# EAGLE design main_board (EAGLE 6.4)
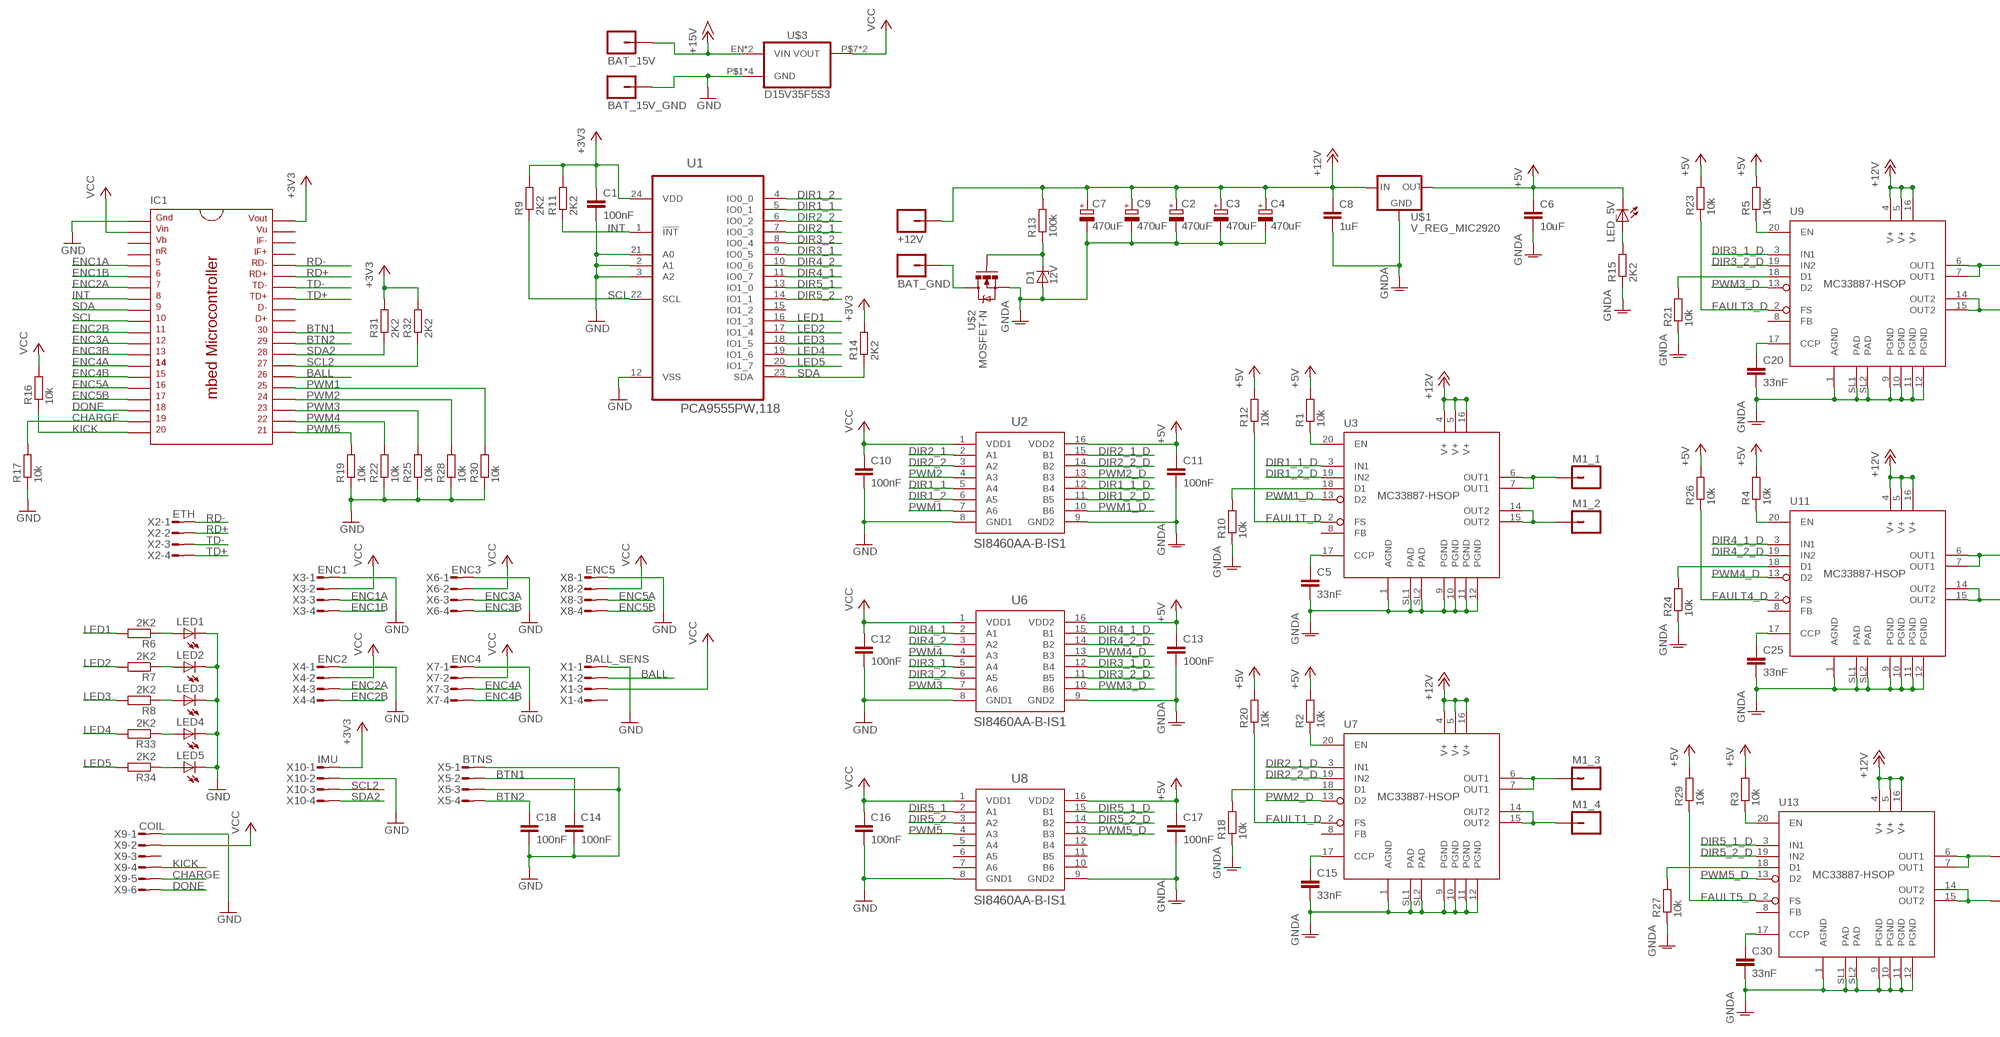
[diagram p0: schematic, sheet 1, part 1 of 2]
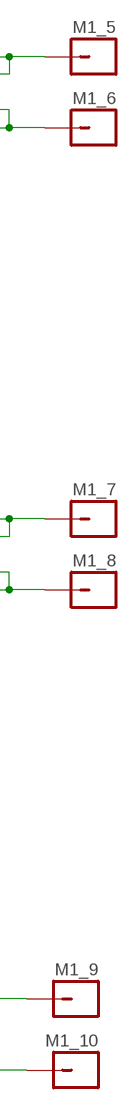
[diagram p1: schematic, sheet 1, part 2 of 2]

## Parts
+12V  M01_PWR  [PWR_HOLE]
BAT_15V  M01_WIRE  [WIRE_HOLE]
BAT_15V_GND  M01_WIRE  [WIRE_HOLE]
BAT_GND  M01_PWR  [PWR_HOLE]
C1  100nF  C-EUC0603K  [C0603K]
C2  470uF  CPOL-EUE3.5-8  [E3,5-8]
C3  470uF  CPOL-EUE3.5-8  [E3,5-8]
C4  470uF  CPOL-EUE3.5-8  [E3,5-8]
C5  33nF  C-EUC0603K  [C0603K]
C6  10uF  C-EUC1206K  [C1206K]
C7  470uF  CPOL-EUE3.5-8  [E3,5-8]
C8  1uF  C-EUC0603K  [C0603K]
C9  470uF  CPOL-EUE3.5-8  [E3,5-8]
C10  100nF  C-EUC0603K  [C0603K]
C11  100nF  C-EUC0603K  [C0603K]
C12  100nF  C-EUC0603K  [C0603K]
C13  100nF  C-EUC0603K  [C0603K]
C14  100nF  C-EUC0603K  [C0603K]
C15  33nF  C-EUC0603K  [C0603K]
C16  100nF  C-EUC0603K  [C0603K]
C17  100nF  C-EUC0603K  [C0603K]
C18  100nF  C-EUC0603K  [C0603K]
C20  33nF  C-EUC0603K  [C0603K]
C25  33nF  C-EUC0603K  [C0603K]
C30  33nF  C-EUC0603K  [C0603K]
D1  12V  ZENER-DIODESOD123  [SOD123]
IC1  MBED_MICROCONTROLLER  [DIL40_0.9]
LED1  LEDCHIP-LED0603  [CHIP-LED0603]
LED2  LEDCHIP-LED0603  [CHIP-LED0603]
LED3  LEDCHIP-LED0603  [CHIP-LED0603]
LED4  LEDCHIP-LED0603  [CHIP-LED0603]
LED5  LEDCHIP-LED0603  [CHIP-LED0603]
LED_5V  LEDCHIP-LED0603  [CHIP-LED0603]
M1_1  M01_WIRE  [WIRE_HOLE]
M1_2  M01_WIRE  [WIRE_HOLE]
M1_3  M01_WIRE  [WIRE_HOLE]
M1_4  M01_WIRE  [WIRE_HOLE]
M1_5  M01_WIRE  [WIRE_HOLE]
M1_6  M01_WIRE  [WIRE_HOLE]
M1_7  M01_WIRE  [WIRE_HOLE]
M1_8  M01_WIRE  [WIRE_HOLE]
M1_9  M01_WIRE  [WIRE_HOLE]
M1_10  M01_WIRE  [WIRE_HOLE]
R1  10k  R-EU_R0603  [R0603]
R2  10k  R-EU_R0603  [R0603]
R3  10k  R-EU_R0603  [R0603]
R4  10k  R-EU_R0603  [R0603]
R5  10k  R-EU_R0603  [R0603]
R6  2K2  R-EU_R0603  [R0603]
R7  2K2  R-EU_R0603  [R0603]
R8  2K2  R-EU_R0603  [R0603]
R9  2K2  R-EU_R0603  [R0603]
R10  10k  R-EU_R0603  [R0603]
R11  2K2  R-EU_R0603  [R0603]
R12  10k  R-EU_R0603  [R0603]
R13  100k  R-EU_R0603  [R0603]
R14  2K2  R-EU_R0603  [R0603]
R15  2K2  R-EU_R0603  [R0603]
R16  10k  R-EU_R0603  [R0603]
R17  10k  R-EU_R0603  [R0603]
R18  10k  R-EU_R0603  [R0603]
R19  10k  R-EU_R0603  [R0603]
R20  10k  R-EU_R0603  [R0603]
R21  10k  R-EU_R0603  [R0603]
R22  10k  R-EU_R0603  [R0603]
R23  10k  R-EU_R0603  [R0603]
R24  10k  R-EU_R0603  [R0603]
R25  10k  R-EU_R0603  [R0603]
R26  10k  R-EU_R0603  [R0603]
R27  10k  R-EU_R0603  [R0603]
R28  10k  R-EU_R0603  [R0603]
R29  10k  R-EU_R0603  [R0603]
R30  10k  R-EU_R0603  [R0603]
R31  2K2  R-EU_R0603  [R0603]
R32  2K2  R-EU_R0603  [R0603]
R33  2K2  R-EU_R0603  [R0603]
R34  2K2  R-EU_R0603  [R0603]
U1  PCA9555PW,118  [SOP65P640X110-24N]
U2  SI8460AA-B-IS1  [SOIC-16]
U3  MC33887-HSOP  [HSOP]
U6  SI8460AA-B-IS1  [SOIC-16]
U7  MC33887-HSOP  [HSOP]
U8  SI8460AA-B-IS1  [SOIC-16]
U9  MC33887-HSOP  [HSOP]
U11  MC33887-HSOP  [HSOP]
U13  MC33887-HSOP  [HSOP]
U$1  V_REG_MIC2920  [SOT223]
U$2  MOSFET-N  MOSFET-N-SOT669  [TO127P600X120-5N]
U$3  D15V35F5S3  [D15V35F5S3]
X1  BALL_SENS  MICROMATCH-4  [MICROMATCH-4]
X2  ETH  MICROMATCH-4  [MICROMATCH-4]
X3  ENC1  MICROMATCH-4  [MICROMATCH-4]
X4  ENC2  MICROMATCH-4  [MICROMATCH-4]
X5  BTNS  MICROMATCH-4  [MICROMATCH-4]
X6  ENC3  MICROMATCH-4  [MICROMATCH-4]
X7  ENC4  MICROMATCH-4  [MICROMATCH-4]
X8  ENC5  MICROMATCH-4  [MICROMATCH-4]
X9  COIL  MICROMATCH-6  [MICROMATCH-6]
X10  IMU  MICROMATCH-4  [MICROMATCH-4]

## Nets
+3V3: C1.1 IC1.40 R9.2 R11.2 R14.2 R31.2 R32.2 U1.24(VDD) X10.1
+5V: C6.1 C11.1 C13.1 C17.1 LED_5V.C R1.2 R2.2 R3.2 R4.2 R5.2 R12.2 R20.2 R23.2 R26.2 R29.2 U2.16(VDD2) U6.16(VDD2) U8.16(VDD2) U$1.3(OUT)
+12V: +12V.P$1 C2.+ C3.+ C4.+ C7.+ C8.1 C9.+ R13.2 U3.4(V+) U3.5(V+) U3.16(V+) U7.4(V+) U7.5(V+) U7.16(V+) U9.4(V+) U9.5(V+) U9.16(V+) U11.4(V+) U11.5(V+) U11.16(V+) U13.4(V+) U13.5(V+) U13.16(V+) U$1.1(IN)
+15V: BAT_15V.P$1 U$3.EN(VIN) U$3.P$5(VIN)
BALL: IC1.26 X1.2
BTN1: C14.1 IC1.30 X5.2
BTN2: C18.1 IC1.29 X5.4
CHARGE: IC1.19 R17.2 X9.5
DIR1_1: U1.5(IO0_1) U2.5(A4)
DIR1_1_D: U2.12(B4) U3.3(IN1)
DIR1_2: U1.4(IO0_0) U2.6(A5)
DIR1_2_D: U2.11(B5) U3.19(IN2)
DIR2_1: U1.7(IO0_3) U2.2(A1)
DIR2_1_D: U2.15(B1) U7.3(IN1)
DIR2_2: U1.6(IO0_2) U2.3(A2)
DIR2_2_D: U2.14(B2) U7.19(IN2)
DIR3_1: U1.9(IO0_5) U6.5(A4)
DIR3_1_D: U6.12(B4) U9.3(IN1)
DIR3_2: U1.8(IO0_4) U6.6(A5)
DIR3_2_D: U6.11(B5) U9.19(IN2)
DIR4_1: U1.11(IO0_7) U6.2(A1)
DIR4_1_D: U6.15(B1) U11.3(IN1)
DIR4_2: U1.10(IO0_6) U6.3(A2)
DIR4_2_D: U6.14(B2) U11.19(IN2)
DIR5_1: U1.13(IO1_0) U8.2(A1)
DIR5_1_D: U8.15(B1) U13.3(IN1)
DIR5_2: U1.14(IO1_1) U8.3(A2)
DIR5_2_D: U8.14(B2) U13.19(IN2)
DONE: IC1.18 X9.6
ENC1A: IC1.5 X3.3
ENC1B: IC1.6 X3.4
ENC2A: IC1.7 X4.3
ENC2B: IC1.11 X4.4
ENC3A: IC1.12 X6.3
ENC3B: IC1.13 X6.4
ENC4A: IC1.14 X7.3
ENC4B: IC1.15 X7.4
ENC5A: IC1.16 X8.3
ENC5B: IC1.17 X8.4
FAUL1T_D: R12.1 U3.2(FS)
FAULT1_D: R20.1 U7.2(FS)
FAULT3_D: R23.1 U9.2(FS)
FAULT4_D: R26.1 U11.2(FS)
FAULT5_D: R29.1 U13.2(FS)
GND: BAT_15V_GND.P$1 C1.2 C10.2 C12.2 C14.2 C16.2 C18.2 IC1.1 LED1.C LED2.C LED3.C LED4.C LED5.C R17.1 R19.1 R22.1 R25.1 R28.1 R30.1 U1.2(A1) U1.3(A2) U1.12(VSS) U1.21(A0) U2.8(GND1) U6.8(GND1) U8.8(GND1) U$3.P$1(GND) U$3.P$2(GND) U$3.P$3(GND) U$3.P$4(GND) X1.1 X3.1 X4.1 X5.1 X5.3 X6.1 X7.1 X8.1 X9.1 X10.2
GNDA: C2.- C3.- C4.- C5.2 C6.2 C7.- C8.2 C9.- C11.2 C13.2 C15.2 C17.2 C20.2 C25.2 C30.2 D1.A R10.1 R15.1 R18.1 R21.1 R24.1 R27.1 U2.9(GND2) U3.1(AGND) U3.9(PGND) U3.10(PGND) U3.11(PGND) U3.12(PGND) U3.SL1(PAD) U3.SL2(PAD) U6.9(GND2) U7.1(AGND) U7.9(PGND) U7.10(PGND) U7.11(PGND) U7.12(PGND) U7.SL1(PAD) U7.SL2(PAD) U8.9(GND2) U9.1(AGND) U9.9(PGND) U9.10(PGND) U9.11(PGND) U9.12(PGND) U9.SL1(PAD) U9.SL2(PAD) U11.1(AGND) U11.9(PGND) U11.10(PGND) U11.11(PGND) U11.12(PGND) U11.SL1(PAD) U11.SL2(PAD) U13.1(AGND) U13.9(PGND) U13.10(PGND) U13.11(PGND) U13.12(PGND) U13.SL1(PAD) U13.SL2(PAD) U$1.2(GND) U$1.4(GND) U$2.1(S) U$2.2(S) U$2.3(S)
INT: IC1.8 R11.1 U1.1(!INT)
KICK: IC1.20 R16.1 X9.4
LED1: R6.2 U1.16(IO1_3)
LED2: R7.2 U1.17(IO1_4)
LED3: R8.2 U1.18(IO1_5)
LED4: R33.2 U1.19(IO1_6)
LED5: R34.2 U1.20(IO1_7)
N$2: R1.1 U3.20(EN)
N$3: R2.1 U7.20(EN)
N$4: R3.1 U13.20(EN)
N$5: R4.1 U11.20(EN)
N$6: R5.1 U9.20(EN)
N$7: LED1.A R6.1
N$8: LED2.A R7.1
N$9: LED3.A R8.1
N$10: LED_5V.A R15.2
N$11: LED4.A R33.1
N$12: LED5.A R34.1
N$15: C5.1 U3.17(CCP)
N$18: R10.2 U3.18(D1)
N$20: D1.C R13.1 U$2.4(G)
N$21: BAT_GND.P$1 U$2.5(D)
N$23: M1_1.P$1 U3.6(OUT1) U3.7(OUT1)
N$25: M1_2.P$1 U3.14(OUT2) U3.15(OUT2)
N$31: C15.1 U7.17(CCP)
N$33: R18.2 U7.18(D1)
N$34: M1_3.P$1 U7.6(OUT1) U7.7(OUT1)
N$35: M1_4.P$1 U7.14(OUT2) U7.15(OUT2)
N$36: C20.1 U9.17(CCP)
N$38: R21.2 U9.18(D1)
N$39: M1_5.P$1 U9.6(OUT1) U9.7(OUT1)
N$40: M1_6.P$1 U9.14(OUT2) U9.15(OUT2)
N$41: C25.1 U11.17(CCP)
N$43: R24.2 U11.18(D1)
N$44: M1_7.P$1 U11.6(OUT1) U11.7(OUT1)
N$45: M1_8.P$1 U11.14(OUT2) U11.15(OUT2)
N$46: C30.1 U13.17(CCP)
N$48: R27.2 U13.18(D1)
N$49: M1_9.P$1 U13.6(OUT1) U13.7(OUT1)
N$50: M1_10.P$1 U13.14(OUT2) U13.15(OUT2)
PWM1: IC1.25 R30.2 U2.7(A6)
PWM1_D: U2.10(B6) U3.13(D2)
PWM2: IC1.24 R28.2 U2.4(A3)
PWM2_D: U2.13(B3) U7.13(D2)
PWM3: IC1.23 R25.2 U6.7(A6)
PWM3_D: U6.10(B6) U9.13(D2)
PWM4: IC1.22 R22.2 U6.4(A3)
PWM4_D: U6.13(B3) U11.13(D2)
PWM5: IC1.21 R19.2 U8.4(A3)
PWM5_D: U8.13(B3) U13.13(D2)
RD+: IC1.35 X2.2
RD-: IC1.36 X2.1
SCL: IC1.10 R9.1 U1.22(SCL)
SCL2: IC1.27 R32.1 X10.3
SDA: IC1.9 R14.1 U1.23(SDA)
SDA2: IC1.28 R31.1 X10.4
TD+: IC1.33 X2.4
TD-: IC1.34 X2.3
VCC: C10.1 C12.1 C16.1 IC1.2 R16.2 U2.1(VDD1) U6.1(VDD1) U8.1(VDD1) U$3.P$7(VOUT) U$3.P$8(VOUT) X1.3 X3.2 X4.2 X6.2 X7.2 X8.2 X9.2
Unconnected: IC1.3 IC1.4 IC1.31 IC1.32 IC1.37 IC1.38 IC1.39 U1.15(IO1_2) U3.8(FB) U7.8(FB) U8.5(A4) U8.6(A5) U8.7(A6) U8.10(B6) U8.11(B5) U8.12(B4) U9.8(FB) U11.8(FB) U13.8(FB) X1.4 X9.3

## Library data of the parts
+12V BAT_GND = tellis2:M01_PWR
BAT_15V BAT_15V_GND M1_1-M1_10 = tellis2:M01_WIRE
C1 C5 C6 C8 C10-C18 C20 C25 C30 = rcl:C-EU: CAPACITOR, European symbol
C2-C4 C7 C9 = rcl:CPOL-EU: POLARIZED CAPACITOR, European symbol
D1 = diode:ZENER-DIODE: Z-Diode
IC1 = mbed-microcontroller:MBED_MICROCONTROLLER: mbed Microcontroller, DIP40, 0.9"
LED1-LED5 LED_5V = led:LED: LED OSRAM: - CHIPLED LG R971, LG N971, LY N971, LG Q971, LY Q971, LO R971, LY R971 LH N974, LH R974 LS Q976, LO Q976, LY Q976 LO Q996 - Hyper CHIPLED LW Q18S LB Q993, LB Q99A, LB R99A - SideLED LS A670, LO A670, LY A670, LG A670, LP A670 LB A673, LV A673, LT A673, LW A673 LH A674 LY A675 LS A676, LA A676, LO A676, LY A676, LW A676 LS A679, LY A679, LG A679 - Hyper Micro SIDELED® LS Y876, LA Y876, LO Y876, LY Y876 LT Y87S - SmartLED LW L88C, LW L88S LB L89C, LB L89S, LG L890 LS L89K, LO L89K, LY L89K LS L896, LA L896, LO L896, LY L896 - TOPLED LS T670, LO T670, LY T670, LG T670, LP T670 LSG T670, LSP T670, LSY T670, LOP T670, LYG T670 LG T671, LOG T671, LSG T671 LB T673, LV T673, LT T673, LW T673 LH T674 LS T676, LA T676, LO T676, LY T676, LB T676, LH T676, LSB T676, LW T676 LB T67C, LV T67C, LT T67C, LS T67K, LO T67K, LY T67K, LW E67C LS E67B, LA E67B, LO E67B, LY E67B, LB E67C, LV E67C, LT E67C LW T67C LS T679, LY T679, LG T679 LS T770, LO T770, LY T770, LG T770, LP T770 LB T773, LV T773, LT T773, LW T773 LH T774 LS E675, LA E675, LY E675, LS T675 LS T776, LA T776, LO T776, LY T776, LB T776 LHGB T686 LT T68C, LB T68C - Hyper Mini TOPLED® LB M676 - Mini TOPLED Santana® LG M470 LS M47K, LO M47K, LY M47K Source: http://www.osram.convergy.de LUXEON: - LUMILED® LXK2-PW12-R00, LXK2-PW12-S00, LXK2-PW14-U00, LXK2-PW14-V00 LXK2-PM12-R00, LXK2-PM12-S00, LXK2-PM14-U00 LXK2-PE12-Q00, LXK2-PE12-R00, LXK2-PE12-S00, LXK2-PE14-T00, LXK2-PE14-U00 LXK2-PB12-K00, LXK2-PB12-L00, LXK2-PB12-M00, LXK2-PB14-N00, LXK2-PB14-P00, LXK2-PB14-Q00 LXK2-PR12-L00, LXK2-PR12-M00, LXK2-PR14-Q00, LXK2-PR14-R00 LXK2-PD12-Q00, LXK2-PD12-R00, LXK2-PD12-S00 LXK2-PH12-R00, LXK2-PH12-S00 LXK2-PL12-P00, LXK2-PL12-Q00, LXK2-PL12-R00 Source: www.luxeon.com KINGBRIGHT: KA-3528ASYC Source: www.kingbright.com
R1-R34 = rcl:R-EU_: RESISTOR, European symbol
U1 = PCA9555:PCA9555PW,118: IC, I/O EXPANDER, 16BIT, 24TSSOP; MPN: PCA9555PW,118; OC_FARNELL: 2101299; OC_NEWARK: 70R6680; PACKAGE: 24TSSOP; SUPPLIER: NXP
U2 U6 U8 = si8460:SI8460AA-B-IS1
U3 U7 U9 U11 U13 = mc33887:MC33887-HSOP: 5.0 A H-Bridge with Load Current Feedback
U$1 = SparkFun-PowerIC:V_REG_MIC2920: MIC2920A (http://www.micrel.com/_PDF/mic2920.pdf) - 400mA output LDO Regulator
U$2 = nxp_sot669:MOSFET-N-SOT669
U$3 = D15V35F5S3:D15V35F5S3
X1-X8 X10 = con-amp-micromatch:MICROMATCH-4: MicroMaTch 4 7-215464-4 / 0-215464-4 Drawing Number C-215464 DDEController.pdf; MPN: 7-215464-4; OC_FARNELL: 3784629; OC_NEWARK: 19R8124
X9 = con-amp-micromatch:MICROMATCH-6: MicroMaTch 6 7-215464-6 / 0-215464-6 Drawing Number C-215464 DDEController.pdf; MPN: 7-215464-6; OC_FARNELL: 3784630; OC_NEWARK: 19R8125

## Board
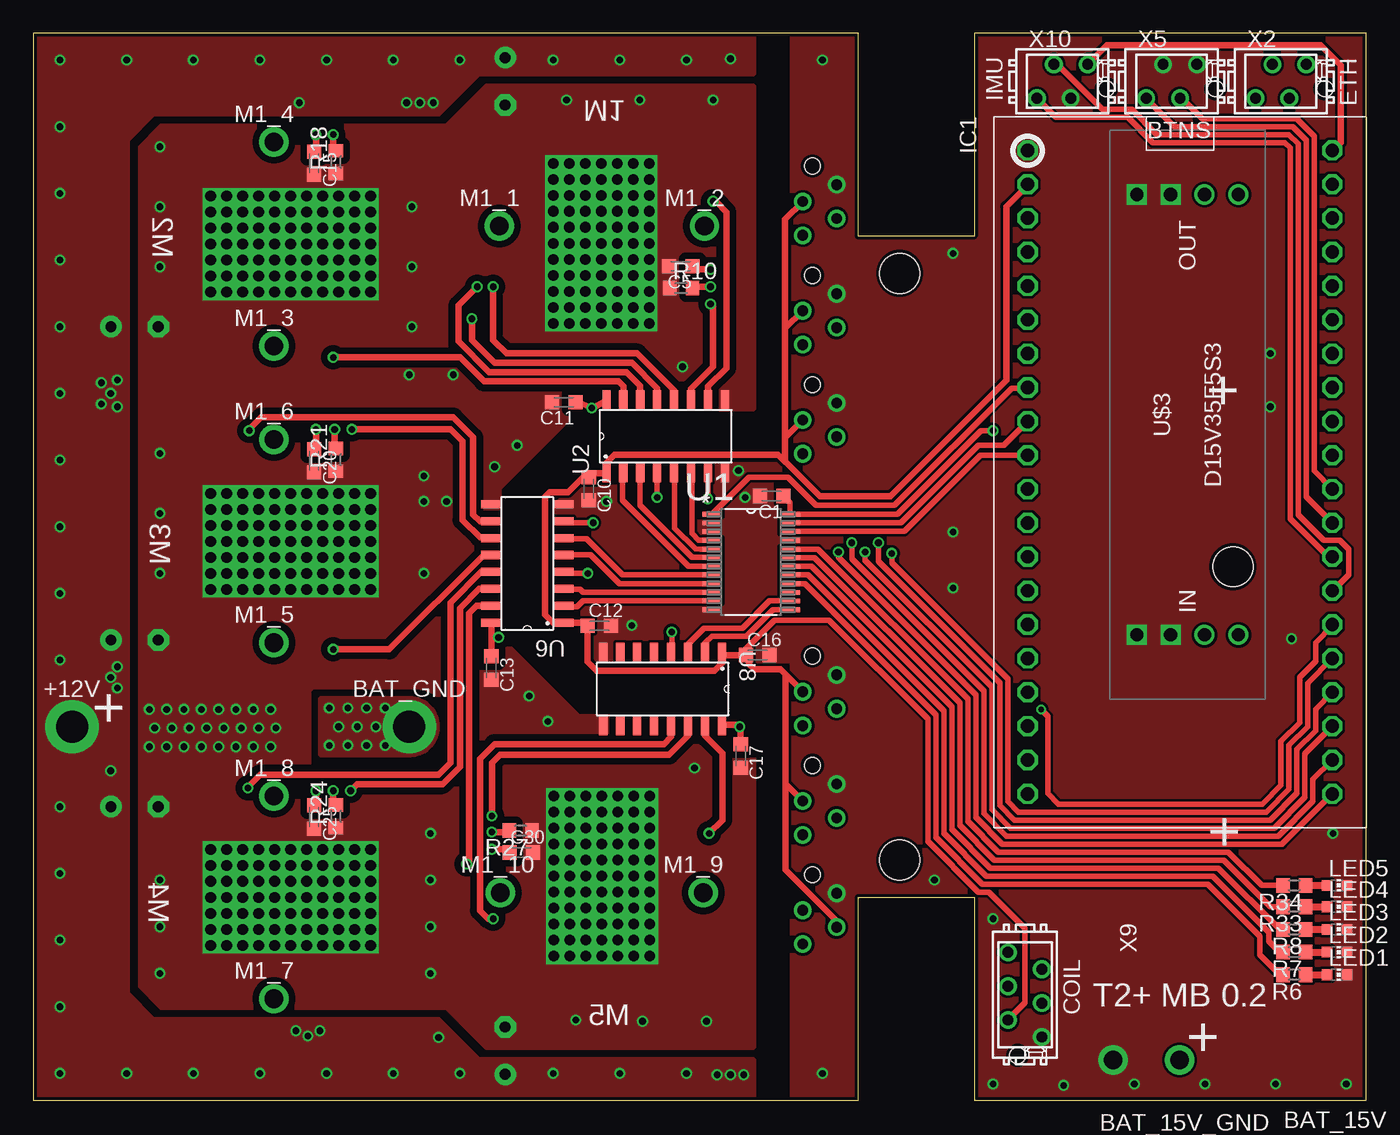
[diagram p2: board, top side]
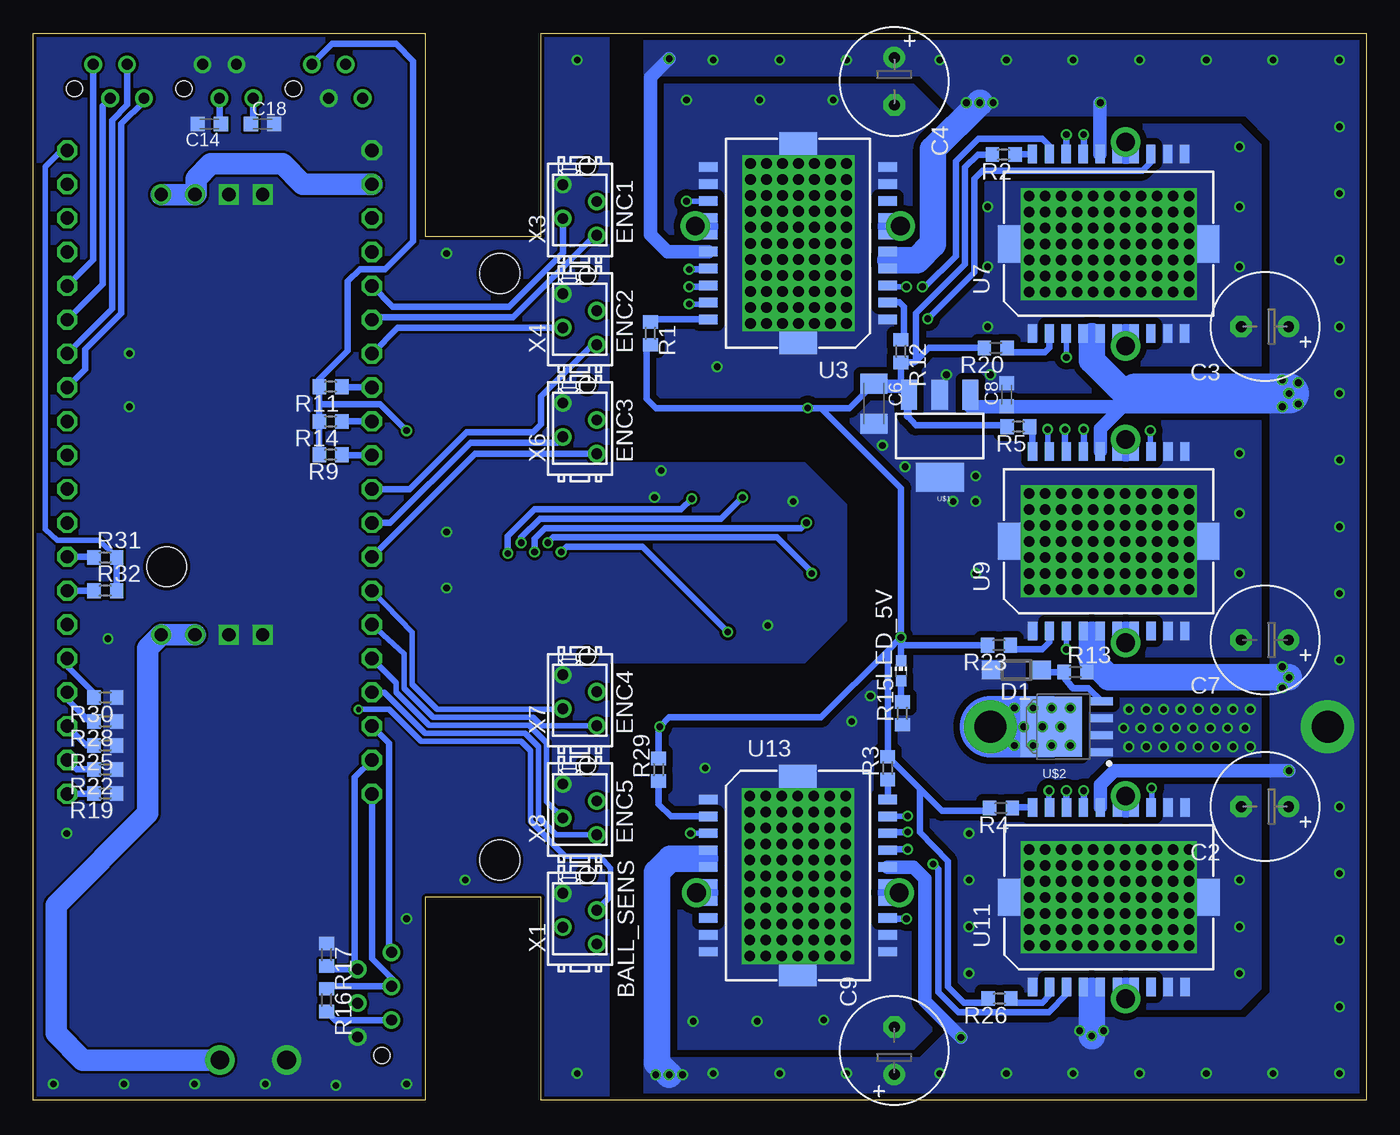
[diagram p3: board, bottom side, seen from below]

Size 100 x 80 mm. Coordinates in mm from the lower left corner, seen from the top.
Outline: 0,0 61.9,0 61.9,15.2 70.6,15.2 70.6,0 100,0 100,80 70.6,80 70.6,64.8 61.9,64.8 61.9,80 0,80 0,0
Copper layers (1*16): Top 0.035mm / dielectric 1.5mm / Bottom 0.035mm
Design rules "Fusion_eagle_rule_v1.1 *": minimum track width 6mil, minimum drill 12mil, track to track 0.2mm, track to pad 0.2mm, pad to pad 0.2mm, via to via 0.2mm, smd to smd 0mil, copper to edge 10mil, drill to drill 10mil, minimum pad ring 10mil, minimum via ring 6mil, stop-mask expansion 2mil, vias tented up to drill 100mil, thermal gap 10mil
Holes 1.2 mm at 58.45,33.3 58.45,25.1 58.45,16.9 58.45,53.65 58.45,61.85 58.45,70.05 80.5,75.85 88.7,75.85 96.9,75.85 73.85,3.35
Holes 3 mm at 65,62 65,18 90,40

### Footprints (pad centres in the part's own frame; a part is rotated, then mirrored left to right if it is on the bottom)
PWR_HOLE = drill 2.4 pad 4: P$1 0,0
WIRE_HOLE = drill 1.4 pad 2.2: P$1 0,0
C0603K = smd 1.05 x 1.08: 1 -0.875,0; 2 0.875,0
E3,5-8 = drill 0.813 pad 1.6: + -1.778,0 | drill 0.813 pad 1.6 octagon: - 1.778,0
C1206K = smd 1.5 x 2: 1 -1.5,0; 2 1.5,0
SOD123 = smd 1.4 x 1.4: A 1.9,0; C -1.9,0
DIL40_0.9 = drill 1 pad 1.397 octagon: 1 -22.86,-11.43; 2 -20.32,-11.43; 3 -17.78,-11.43; 4 -15.24,-11.43; 5 -12.7,-11.43; 6 -10.16,-11.43; 7 -7.62,-11.43; 8 -5.08,-11.43; 9 -2.54,-11.43; 10 0,-11.43; 11 2.54,-11.43; 12 5.08,-11.43; 13 7.62,-11.43; 14 10.16,-11.43; 15 12.7,-11.43; 16 15.24,-11.43; 17 17.78,-11.43; 18 20.32,-11.43; 19 22.86,-11.43; 20 25.4,-11.43; 21 25.4,11.43; 22 22.86,11.43; 23 20.32,11.43; 24 17.78,11.43; 25 15.24,11.43; 26 12.7,11.43; 27 10.16,11.43; 28 7.62,11.43; 29 5.08,11.43; 30 2.54,11.43; 31 0,11.43; 32 -2.54,11.43; 33 -5.08,11.43; 34 -7.62,11.43; 35 -10.16,11.43; 36 -12.7,11.43; 37 -15.24,11.43; 38 -17.78,11.43; 39 -20.32,11.43; 40 -22.86,11.43
CHIP-LED0603 = smd 0.8 x 0.8: A 0,-0.75; C 0,0.75
R0603 = smd 1 x 1.1: 1 -0.85,0; 2 0.85,0
SOP65P640X110-24N = smd 1.473 x 0.356: 1 -2.921,3.581; 2 -2.921,2.921; 3 -2.921,2.286; 4 -2.921,1.626; 5 -2.921,0.965; 6 -2.921,0.33; 7 -2.921,-0.33; 8 -2.921,-0.965; 9 -2.921,-1.626; 10 -2.921,-2.286; 11 -2.921,-2.921; 12 -2.921,-3.581; 13 2.921,-3.581; 14 2.921,-2.921; 15 2.921,-2.286; 16 2.921,-1.626; 17 2.921,-0.965; 18 2.921,-0.33; 19 2.921,0.33; 20 2.921,0.965; 21 2.921,1.626; 22 2.921,2.286; 23 2.921,2.921; 24 2.921,3.581
SOIC-16 = smd 1.549 x 0.61: 1 -2.692,4.445; 2 -2.692,3.175; 3 -2.692,1.905; 4 -2.692,0.635; 5 -2.692,-0.635; 6 -2.692,-1.905; 7 -2.692,-3.175; 8 -2.692,-4.445; 9 2.692,-4.445; 10 2.692,-3.175; 11 2.692,-1.905; 12 2.692,-0.635; 13 2.692,0.635; 14 2.692,1.905; 15 2.692,3.175; 16 2.692,4.445
HSOP = smd 0.7 x 1.4: 1 -5.715,-6.731; 2 -4.445,-6.731; 3 -3.175,-6.731; 4 -1.905,-6.731; 5 -0.635,-6.731; 6 0.635,-6.731; 7 1.905,-6.731; 8 3.175,-6.731; 9 4.445,-6.731; 10 5.715,-6.731; 11 5.715,6.731; 12 4.445,6.731; 13 3.175,6.731; 14 1.905,6.731; 15 0.635,6.731; 16 -0.635,6.731; 17 -1.905,6.731; 18 -3.175,6.731; 19 -4.445,6.731; 20 -5.715,6.731 | smd 2.15 x 2.8: SL1 -7.239,0; SL2 7.239,0
SOT223 = smd 1.219 x 2.235: 1 -2.311,-3.099; 2 0,-3.099; 3 2.311,-3.099 | smd 3.6 x 2.2: 4 0,3.099
TO127P600X120-5N = smd 1.65 x 0.6: 1 -2.65,1.905; 2 -2.65,0.635; 3 -2.65,-0.635; 4 -2.65,-1.905 | smd 4.6 x 4.5: 5 1.15,0
D15V35F5S3 = drill 1: EN -16.51,-3.81; P$5 -16.51,-1.27; P$7 16.51,-1.27; P$8 16.51,-3.81 | drill 1 square: P$1 -16.51,3.81; P$2 -16.51,1.27; P$3 16.51,3.81; P$4 16.51,1.27
MICROMATCH-4 = drill 0.813: 1 1.905,1.27; 2 0.635,-1.27; 3 -0.635,1.27; 4 -1.905,-1.27
MICROMATCH-6 = drill 0.813: 1 3.175,1.27; 2 1.905,-1.27; 3 0.635,1.27; 4 -0.635,-1.27; 5 -1.905,1.27; 6 -3.175,-1.27

### Placement (x,y rotation side)
+12V  2.9,28 0 top
BAT_15V  86,3 0 top
BAT_15V_GND  81,3 0 top
BAT_GND  28.2,28 0 top
C1  55.4,45.3 180 top
C2  7.6,22 180 bottom
C3  7.6,58 180 bottom
C4  35.4,76.4 270 bottom
C5  48.58,62.53 180 top
C6  36.93,52.23 270 bottom
C7  7.6,34.5 180 bottom
C8  26.97,52.89 90 bottom
C9  35.4,3.7 90 bottom
C10  41.67,45.85 270 top
C11  39.8,52.33 180 top
C12  42.45,35.57 0 top
C13  34.37,32.4 270 top
C14  86.8,73.2 180 bottom
C15  21.07,70.26 270 top
C16  54.35,33.37 0 top
C17  53.07,25.8 270 top
C18  82.8,73.2 0 bottom
C20  21.07,47.94 270 top
C25  21.07,21.22 270 top
C30  36.6,18.57 0 top
D1  26.25,32.26 180 bottom
IC1  86.03,48.36 270 top
LED1  97.8,9.4 270 top
LED2  97.8,11.1 270 top
LED3  97.8,12.8 270 top
LED4  97.8,14.5 270 top
LED5  97.8,16.1 270 top
LED_5V  34.9,32.2 0 bottom
M1_1  34.95,65.55 0 top
M1_2  50.35,65.55 0 top
M1_3  18.05,56.55 0 top
M1_4  18.05,71.85 0 top
M1_5  18.05,34.3 0 top
M1_6  18.05,49.55 0 top
M1_7  18.05,7.6 0 top
M1_8  18.05,22.8 0 top
M1_9  50.25,15.55 0 top
M1_10  35.05,15.55 0 top
R1  53.7,57.5 270 bottom
R2  27.2,70.9 180 bottom
R3  35.9,24.9 90 bottom
R4  27.4,21.9 180 bottom
R5  26.1,50.5 180 bottom
R6  94.6,9.4 180 top
R7  94.6,11.1 180 top
R8  94.6,12.8 180 top
R9  77.7,48.4 180 bottom
R10  48.61,60.89 0 top
R11  77.7,53.5 180 bottom
R12  34.91,56.17 270 bottom
R13  21.81,32.09 0 bottom
R14  77.7,50.9 180 bottom
R15  34.8,29 90 bottom
R16  78,7.5 270 bottom
R17  78,10.9 270 bottom
R18  22.71,70.35 90 top
R19  94.6,23 180 bottom
R20  27.79,56.41 180 bottom
R21  22.71,48.01 90 top
R22  94.6,24.8 180 bottom
R23  27.55,34.11 180 bottom
R24  22.71,21.27 90 top
R25  94.6,26.6 180 bottom
R26  27.51,7.61 180 bottom
R27  36.57,20.21 180 top
R28  94.6,28.4 180 bottom
R29  53.09,24.77 90 bottom
R30  94.6,30.2 180 bottom
R31  94.6,40.7 0 bottom
R32  94.6,38.2 0 bottom
R33  94.6,14.5 180 top
R34  94.6,16.1 180 top
U1  53.85,40.35 0 top
U2  47.44,49.78 90 top
U3  42.62,64.26 90 bottom
U6  37.06,40.24 180 top
U7  19.33,64.21 0 bottom
U8  47.21,30.83 270 top
U9  19.32,41.91 0 bottom
U11  19.31,15.21 0 bottom
U13  42.64,16.83 270 bottom
U$1  32,49.8 180 bottom
U$2  22.5,28 180 bottom
U$3  86.6,51.4 90 top
X1  59,13.6 90 bottom
X2  93.6,76.4 0 top
X3  59,66.75 90 bottom
X4  59,58.56 90 bottom
X5  85.4,76.4 0 top
X6  59,50.37 90 bottom
X7  59,29.98 90 bottom
X8  59,21.79 90 bottom
X9  74.4,7.9 270 top
X10  77.2,76.4 0 top

### Tracks (layer width: path | path; a pad name or v marks a point on that pad's centre or on a via)
+3V3  (via drill 0.5)
  Top 0.4: v72,50.2 71.1,50.2 64.83,43.93 U1.24 56.77,44.8 C1.1
  Top 0.5: IC1.40 97.52,71.22 98.1,71.8 98.1,77.6 96.6,79.1 80.53,79.1 X10.1
  Bottom 0.4: R31.2 95.05,42 98.2,42 99.1,42.8 99.1,70 97.88,71.22 IC1.40
  Bottom 0.5: 78.55,52.2 R14.2 R9.2 | v72,50.2 74,52.2 78.55,52.2 | 78.55,52.2 R11.2 78.55,54.05 76.4,56.2 76.4,61.4 75.5,62.3 73.6,62.3 71.5,64.4 71.5,77.9 72.8,79.2 77.58,79.2 X10.1 | R32.2 R31.2
+5V  (via drill 0.5)
  Top 0.5: 51.62,28.07 U8.16 52.86,28.14 v53,28 53.07,27.93 C17.1 | C13.1 34.37,34.8 | 34.37,34.8 U6.16 | v34.9,34.7 34.47,34.7 34.37,34.8 | C11.1 40.74,52.4 v41.9,51.9 42.92,52.4 U2.16
  Bottom 0.5: R5.2 27.1,50.6 33.8,50.6 34.4,51.3 | 34.4,52.81 U$1.3 34.31,53.52 34.91,53.82 R12.2 33.88,55.32 33.8,55.4 | 35.93,25.72 R3.2 | R4.2 28.46,21.69 31.84,21.69 33.5,23.35 | R23.2 29.11,34.1 34.6,34.1 34.9,34.4 | 33.8,55.4 33.8,59 30.1,62.7 30.1,69.95 29.15,70.9 R2.2 | 33.5,23.35 33.5,20.1 31.4,17.9 31.4,8.5 30.2,7.3 28.67,7.3 R26.2 | 33.5,23.35 R3.2 | 35.9,33.7 40.9,28.7 52.3,28.7 v53,28 53.09,27.91 R29.2 | 35.9,33.7 v34.9,34.7 | R3.2 35.9,33.7 | LED_5V.C 34.9,34.4 | C6.1 38.76,51.9 40.9,51.9 | 40.9,51.9 v41.9,51.9 53.3,51.9 54,52.6 54,56.3 53.7,56.6 R1.2 | R20.2 32.79,56.41 33.8,55.4 | v34.9,34.7 34.9,45.9 40.9,51.9 | 34.9,34.4 v34.9,34.7
  Bottom 0.6: 34.4,51.3 34.4,52.81
  Bottom 1: 34.31,53.52 36.72,53.52 C6.1
+12V  (via drill 0.5)
  Bottom 0.5: U13.5 49.37,17.87 49.6,18.1 49.37,18.33 U13.4 | U7.5 20.42,57.48 20.6,57.3 20.86,57.5 U7.4 | U3.5 35.89,63.19 35.7,63 35.89,62.81 U3.4 | U9.5 20.32,35.18 20.6,34.9 20.88,35.18 U9.4 | U11.5 20.32,8.48 20.6,8.2 20.88,8.48 U11.4 | R13.2 20.4,32.65 20.25,32.65
  Bottom 1: U11.16 19.95,23.66 18.9,24.7 v5.8,24.7 | U13.16 33.97,17.46 33.1,16.6 33.1,7.4 v30.4,4.7 | U3.16 52.42,63.62 53.7,64.9 53.7,76.7 v52.3,78.1 | U$1.1 29.69,52 27.5,52 | U9.16 19.95,50.34 17.3,53 | 27.5,52 16.8,52 15.8,53 | C8.1 27.48,52.02 27.5,52 | 19.96,74.77 U7.16
  Bottom 2: 49.6,18.1 52.2,18.1 53.2,17.1 53.2,2.8 v52.3,1.9 | v5.8,53 7.9,52.9 | 35.7,63 33.7,63 32.5,64.2 32.5,71.3 v29,74.8 | 20.6,34.9 20.6,33 20.25,32.65 19.3,31.7 v5.8,31.7 | 20.6,8.2 v20.6,4.8 | 17.3,53 18.1,53 20.6,55.5 20.6,57.3
  Bottom 3: 17.3,53 15.8,53 v5.8,53
  other vias: 19.95,74.8 2,2 2,78 44,78 39,78 49,78 32,78 27,78 22,78 17,78 12,78 30,74.8 28,74.8 7,78 2,73 2,68 2,63 6.3,52 6.3,54 5.1,53.8 5.1,52.2 2,58 2,53 2,48 2,43 2,38 2,33 6.3,32.5 6.3,30.9 2,22 2,17 2,12 2,7 7,2 12,2 17,2 19.7,5.2 21.5,5.2 22,2 27,2 53.3,1.9 51.3,1.9 32,2 39,2 44,2 49,2
  pour Bottom (isolate 0.5, no thermals): 0,0 54,0 54,3 33.4,3 30.4,6 9,6 7,8 7,72 9,74 30.4,74 33.4,77 54,77 54,80 0,80
  pour Top (no thermals): 54,0 0,0 0,80 54,80 54,77 33.4,77 30.4,74 9,74 7,72 7,8 9,6 30.4,6 33.4,3 54,3
+15V
  Bottom 1.6: BAT_15V.P$1 96.3,3 98.3,5 98.3,14.6 91.4,21.5 91.4,33.9 U$3.EN U$3.P$5
BALL  (via drill 0.4)
  Top 0.4: v75.6,29.3 76.1,28.8 76.1,23 76.9,22.2 92.2,22.2 93.6,23.6 93.6,26.9 95,28.3 95,31.7 96.2,32.9 96.2,34.3 97.46,35.56 IC1.26
  Bottom 0.4: X1.2 56.7,15.27 56.7,17.4 57.5,18.3 60.1,18.3 62.7,20.9 62.7,26.2 63.4,26.9 70.9,26.9 73.3,29.3 v75.6,29.3
BTN1
  Top 0.4: IC1.30 96.1,47.18 96.1,72.3 94.8,73.6 87.7,73.6 86.17,75.13 X5.2
  Bottom 0.5: C14.1 86.03,73.2 X5.2
BTN2
  Top 0.4: IC1.29 95.5,45.24 95.5,72 94.5,73 85.6,73 83.5,75.11 X5.4
  Bottom 0.5: C18.1 83.5,73.2 X5.4
CHARGE
  Bottom 0.5: IC1.19 75.9,24.2 75.9,10.1 75.67,9.87 X9.5 77.86,9.8 R17.2
DIR1_1
  Top 0.4: U2.5 48.1,47.06 48.1,42.9 49.67,41.33 50.08,41.31 U1.5
DIR1_1_D  (via drill 0.5)
  Top 0.5: v34.5,61 34.5,57 35.5,56 45.3,56 48.08,53.23 U2.12
  Bottom 0.406: v34.5,61 35.8,61 U3.3
DIR1_2
  Top 0.4: U2.6 49.4,47.03 49.4,42.5 49.91,41.99 49.91,41.98 U1.4
DIR1_2_D  (via drill 0.5)
  Top 0.5: v50.8,59.7 51,59.5 51,55 49.34,53.34 U2.11
  Bottom 0.406: v50.8,59.7 49.47,59.7 U3.19
DIR2_1
  Top 0.4: U2.2 44.2,47.02 44.2,45 49.17,40.03 U1.7
DIR2_1_D  (via drill 0.5)
  Top 0.5: U2.15 44.27,53.53 43.9,53.9 33.8,53.9 32,55.7 v22.5,55.7
  Bottom 0.406: v22.5,55.7 U7.3
DIR2_2
  Top 0.4: U2.3 45.5,47.05 45.5,44.6 49.41,40.69 U1.6
DIR2_2_D  (via drill 0.5)
  Top 0.5: U2.14 45.53,53.56 44.5,54.6 34.2,54.6 31.9,56.9 31.9,59.6 v33.3,61
  Bottom 0.406: 23.9,71.07 U7.19
  Bottom 0.5: U7.19 23.77,71.58 24.3,72.1 29.1,72.1 30.8,70.4 30.8,63.3 33.1,61 v33.3,61
DIR3_1
  Top 0.4: U6.5 39.78,40.9 41.8,40.9 43.97,38.73 50.93,38.73 U1.9
DIR3_1_D  (via drill 0.5)
  Top 0.5: U6.12 33.77,40.88 26.7,33.8 v22.5,33.8
  Bottom 0.406: v22.5,33.8 U9.3
DIR3_2
  Top 0.4: U6.6 39.8,42.1 41.5,42.1 44.2,39.4 50.93,39.4 U1.8
DIR3_2_D  (via drill 0.5)
  Top 0.5: v23.9,50.3 31.3,50.3 32.2,49.4 32.2,43.5 33.5,42.2 34.31,42.2 U6.11
  Bottom 0.406: v23.9,50.3 23.9,48.78 U9.19
DIR4_1
  Top 0.4: U6.2 39.82,37 40.8,37 41.24,37.44 U1.11
DIR4_1_D  (via drill 0.5)
  Top 0.5: U6.15 33.27,37.06 32.7,36.5 32.7,17.9 v32.5,17.7
  Bottom 0.406: 22.5,8.46 U11.3
  Bottom 0.5: v32.5,17.7 32.1,17.3 32.1,8.1 30.6,6.6 23.8,6.6 22.48,7.92 U11.3
DIR4_2
  Top 0.4: U6.3 39.79,38.3 41,38.3 41.23,38.07 50.93,38.07 U1.10
DIR4_2_D  (via drill 0.5)
  Top 0.5: U6.14 33.44,38.34 32,36.9 32,25 30.7,23.7 24.3,23.7 v23.8,23.2
  Bottom 0.406: v23.8,23.2 23.8,21.99 U11.19
DIR5_1
  Top 0.4: U8.2 50.4,33.54 50.4,34.3 50.9,34.8 53.5,34.8 55.48,36.78 U1.13
DIR5_1_D  (via drill 0.5)
  Top 0.5: v50.7,20 51.7,21 51.7,26 50.38,27.32 U8.15
  Bottom 0.406: v50.7,20 U13.3
DIR5_2
  Top 0.4: U8.3 49.1,33.54 49.1,34.2 50.3,35.4 53.2,35.4 55.24,37.44 U1.14
DIR5_2_D  (via drill 0.5)
  Top 0.5: U8.14 49.12,27.32 47.7,25.9 35,25.9 34.4,25.3 v34.4,21.3
  Bottom 0.406: v34.4,21.3 35.88,21.3 U13.19
DONE
  Bottom 0.5: IC1.18 73.3,26.74 73.3,11.2 73.13,11.17 X9.6
ENC1A
  Bottom 0.5: X3.3 60.27,63.53 64.3,59.5 73.04,59.5 IC1.5
ENC1B
  Bottom 0.5: X3.4 57.85,64.84 64,58.7 74.42,58.7 IC1.6
ENC2A
  Bottom 0.5: X4.3 72.66,57.92 IC1.7
ENC2B
  Bottom 0.5: X4.4 57.78,56.6 58.1,56.6 61.9,52.8 61.9,50.7 62.5,50.1 67.5,50.1 71.78,45.82 IC1.11
ENC3A
  Bottom 0.5: X6.3 60.7,49.3 67.2,49.3 73.22,43.28 IC1.12
ENC3B
  Bottom 0.5: X6.4 66.88,48.47 IC1.13
ENC4A
  Bottom 0.4: IC1.14 71.6,35.1 71.6,31.2 69.7,29.3 60.6,29.3 60.45,29.34 X7.3
ENC4B
  Bottom 0.4: X7.4 61.88,28.07 62.5,28.7 70,28.7 72.2,30.9 72.2,33.46 IC1.15
ENC5A
  Bottom 0.4: X8.3 61.5,22.39 61.5,26.8 62.8,28.1 70.3,28.1 72.8,30.6 72.8,31.3 74.6,33.1 IC1.16
ENC5B
  Bottom 0.4: X8.4 60.78,19.89 62.1,21.2 62.1,26.5 63.1,27.5 70.62,27.5 73.7,30.58 IC1.17
FAUL1T_D
  Bottom 0.5: U3.2 35.02,59.81 34.7,59.5 34.7,57.1 34.73,57 R12.1
FAULT1_D
  Bottom 0.5: U7.2 23.77,56.42 24.1,56.1 26.8,56.1 26.9,56.2 26.9,56.27 R20.1
FAULT3_D
  Bottom 0.5: U9.2 23.77,34.34 24.3,33.8 26.5,33.8 26.7,33.81 R23.1
FAULT4_D
  Bottom 0.5: U11.2 23.75,7.84 24.3,7.3 26.35,7.3 R26.1
FAULT5_D
  Bottom 0.5: U13.2 52.17,21.27 53.1,22.2 R29.1
GND  (via drill 0.5)
  other vias: 43,44.9 44.9,35.6 53.4,45.2 52.9,47.2 72,1.2 77.3,1.1 67.6,16.5 69,63.5 98.5,1.2 93.2,1.2 82.6,1.2 87.9,1.2 69,42.6 69,38.4 97.5,20 94.4,34.6 92.8,56 92.8,52 59.2,78 59.2,2 72,13.6
  pour Bottom (no thermals): 100,0 57,0 57,33 42.2,33 39.2,36 39.2,44.6 42.2,47.6 57,47.6 57,80 100,80
  pour Top (no thermals): 100,0 57,0 57,33 42.2,33 39.2,36 39.2,44.6 42.2,47.6 57,47.6 57,80 100,80
GNDA  (via drill 0.5, 0.8)
  other vias: 8.7,29.3 31.5,54.4 36.3,49.1 38.6,28.4 39,70.25 40.2,70.25 41.4,70.25 42.6,70.25 43.8,70.25 45,70.25 46.2,70.25 39,69.05 40.2,69.05 41.4,69.05 42.6,69.05 43.8,69.05 45,69.05 46.2,69.05 39,67.85 40.2,67.85 41.4,67.85 42.6,67.85 43.8,67.85 45,67.85 46.2,67.85 39,66.65 40.2,66.65 41.4,66.65 42.6,66.65 43.8,66.65 45,66.65 46.2,66.65 39,65.45 40.2,65.45 41.4,65.45 42.6,65.45 43.8,65.45 45,65.45 46.2,65.45 39,64.25 40.2,64.25 41.4,64.25 42.6,64.25 43.8,64.25 45,64.25 46.2,64.25 39,63.05 40.2,63.05 41.4,63.05 42.6,63.05 43.8,63.05 45,63.05 46.2,63.05 39,61.85 40.2,61.85 41.4,61.85 42.6,61.85 43.8,61.85 45,61.85 46.2,61.85 39,60.65 40.2,60.65 41.4,60.65 42.6,60.65 43.8,60.65 45,60.65 46.2,60.65 39,59.45 40.2,59.45 41.4,59.45 42.6,59.45 43.8,59.45 45,59.45 46.2,59.45 39,58.25 40.2,58.25 41.4,58.25 42.6,58.25 43.8,58.25 45,58.25 46.2,58.25 16.9,60.6 16.9,61.8 16.9,63 16.9,64.2 16.9,65.4 16.9,66.6 16.9,67.8 13.3,60.6 13.3,61.8 13.3,63 13.3,64.2 13.3,65.4 13.3,66.6 13.3,67.8 18.1,60.6 18.1,61.8 18.1,63 18.1,64.2 18.1,65.4 18.1,66.6 18.1,67.8 14.5,60.6 14.5,61.8 14.5,63 14.5,64.2 14.5,65.4 14.5,66.6 14.5,67.8 15.7,60.6 15.7,61.8 15.7,63 15.7,64.2 15.7,65.4 15.7,66.6 15.7,67.8 19.3,60.6 19.3,61.8 19.3,63 19.3,64.2 19.3,65.4 19.3,66.6 19.3,67.8 20.5,60.6 20.5,61.8 20.5,63 20.5,64.2 20.5,65.4 20.5,66.6 20.5,67.8 21.7,60.6 21.7,61.8 21.7,63 21.7,64.2 21.7,65.4 21.7,66.6 21.7,67.8 25.3,60.6 25.3,61.8 25.3,63 25.3,64.2 25.3,65.4 25.3,66.6 25.3,67.8 24.1,60.6 24.1,61.8 24.1,63 24.1,64.2 24.1,65.4 24.1,66.6 24.1,67.8 22.9,60.6 22.9,61.8 22.9,63 22.9,64.2 22.9,65.4 22.9,66.6 22.9,67.8 16.9,38.3 16.9,39.5 16.9,40.7 16.9,41.9 16.9,43.1 16.9,44.3 16.9,45.5 13.3,38.3 13.3,39.5 13.3,40.7 13.3,41.9 13.3,43.1 13.3,44.3 13.3,45.5 18.1,38.3 18.1,39.5 18.1,40.7 18.1,41.9 18.1,43.1 18.1,44.3 18.1,45.5 14.5,38.3 14.5,39.5 14.5,40.7 14.5,41.9 14.5,43.1 14.5,44.3 14.5,45.5 15.7,38.3 15.7,39.5 15.7,40.7 15.7,41.9 15.7,43.1 15.7,44.3 15.7,45.5 19.3,38.3 19.3,39.5 19.3,40.7 19.3,41.9 19.3,43.1 19.3,44.3 19.3,45.5 20.5,38.3 20.5,39.5 20.5,40.7 20.5,41.9 20.5,43.1 20.5,44.3 20.5,45.5 21.7,38.3 21.7,39.5 21.7,40.7 21.7,41.9 21.7,43.1 21.7,44.3 21.7,45.5 25.3,38.3 25.3,39.5 25.3,40.7 25.3,41.9 25.3,43.1 25.3,44.3 25.3,45.5 24.1,38.3 24.1,39.5 24.1,40.7 24.1,41.9 24.1,43.1 24.1,44.3 24.1,45.5 22.9,38.3 22.9,39.5 22.9,40.7 22.9,41.9 22.9,43.1 22.9,44.3 22.9,45.5 16.9,11.6 16.9,12.8 16.9,14 16.9,15.2 16.9,16.4 16.9,17.6 16.9,18.8 13.3,11.6 13.3,12.8 13.3,14 13.3,15.2 13.3,16.4 13.3,17.6 13.3,18.8 18.1,11.6 18.1,12.8 18.1,14 18.1,15.2 18.1,16.4 18.1,17.6 18.1,18.8 14.5,11.6 14.5,12.8 14.5,14 14.5,15.2 14.5,16.4 14.5,17.6 14.5,18.8 15.7,11.6 15.7,12.8 15.7,14 15.7,15.2 15.7,16.4 15.7,17.6 15.7,18.8 19.3,11.6 19.3,12.8 19.3,14 19.3,15.2 19.3,16.4 19.3,17.6 19.3,18.8 20.5,11.6 20.5,12.8 20.5,14 20.5,15.2 20.5,16.4 20.5,17.6 20.5,18.8 21.7,11.6 21.7,12.8 21.7,14 21.7,15.2 21.7,16.4 21.7,17.6 21.7,18.8 25.3,11.6 25.3,12.8 25.3,14 25.3,15.2 25.3,16.4 25.3,17.6 25.3,18.8 24.1,11.6 24.1,12.8 24.1,14 24.1,15.2 24.1,16.4 24.1,17.6 24.1,18.8 22.9,11.6 22.9,12.8 22.9,14 22.9,15.2 22.9,16.4 22.9,17.6 22.9,18.8 39.05,19.2 40.25,19.2 41.45,19.2 42.65,19.2 43.85,19.2 45.05,19.2 46.25,19.2 39.05,22.8 40.25,22.8 41.45,22.8 42.65,22.8 43.85,22.8 45.05,22.8 46.25,22.8 39.05,18 40.25,18 41.45,18 42.65,18 43.85,18 45.05,18 46.25,18 39.05,21.6 40.25,21.6 41.45,21.6 42.65,21.6 43.85,21.6 45.05,21.6 46.25,21.6 39.05,20.4 40.25,20.4 41.45,20.4 42.65,20.4 43.85,20.4 45.05,20.4 46.25,20.4 39.05,16.8 40.25,16.8 41.45,16.8 42.65,16.8 43.85,16.8 45.05,16.8 46.25,16.8 39.05,15.6 40.25,15.6 41.45,15.6 42.65,15.6 43.85,15.6 45.05,15.6 46.25,15.6 39.05,14.4 40.25,14.4 41.45,14.4 42.65,14.4 43.85,14.4 45.05,14.4 46.25,14.4 39.05,10.8 40.25,10.8 41.45,10.8 42.65,10.8 43.85,10.8 45.05,10.8 46.25,10.8 39.05,12 40.25,12 41.45,12 42.65,12 43.85,12 45.05,12 46.25,12 39.05,13.2 40.25,13.2 41.45,13.2 42.65,13.2 43.85,13.2 45.05,13.2 46.25,13.2 17.8,26.5 12.6,29.3 13,27.9 17.8,29.3 16.5,29.3 16.9,27.9 18.2,27.9 16.5,26.5 14.3,27.9 10,26.5 12.6,26.5 11.3,26.5 15.2,29.3 15.6,27.9 15.2,26.5 11.3,29.3 13.9,29.3 13.9,26.5 11.7,27.9 8.7,26.5 10.4,27.9 9.1,27.9 10,29.3 28.2,54.4 50.5,5.9 45.7,5.9 40.7,6 37.2,30.3 49.6,24.9 29.8,9.5 29.8,13 29.8,16.5 29.8,20 9.5,9.5 9.5,13 9.5,16.5 9.5,39.5 9.5,44 9.5,48.5 29.3,46.8 29.3,44.9 31,44.9 29.3,39.5 9.5,62.5 9.5,67 9.5,71.5 28.4,67 28.4,62.5 28.4,58 48.7,55 40,75 45.5,75 51,75 34.6,47.5
  pour Bottom (isolate 0.5, no thermals): 31,7 9.5,7 8.1,8.4 8.1,71.6 9.5,73 31,73 34,76 54,76 54,51.9 40.9,51.9 34.9,45.9 34.9,34.7 40.9,28.7 54,28.7 54,4 34,4
  pour Top (isolate 0.5, rank 2, no thermals): 54,4 34,4 31,7 9.5,7 8.1,8.4 8.1,71.6 9.5,73 31,73 34,76 54,76 54,51.9 40.9,51.9 34.9,45.9 34.9,34.7 40.9,28.7 54,28.7
INT
  Top 0.4: IC1.8 74.56,53.4 73.4,53.4 64.6,44.6 58.7,44.6 56.6,46.7 53.7,46.7 U1.1
  Bottom 0.5: IC1.8 76.85,53.44 R11.1
KICK
  Bottom 0.5: IC1.20 74.6,10.6 73.1,9.1 73.1,8.56 X9.4 77.61,8.54 R16.1
LED1
  Top 0.4: U1.16 57.88,38.72 67.7,28.9 67.7,19.7 71.2,16.2 88.1,16.2
  Top 0.406: R6.2 93.5,9.4 92,10.9 92,12.3 88.1,16.2
LED2
  Top 0.4: U1.17 58.12,39.38 68.3,29.2 68.3,20 71.5,16.8 88.5,16.8
  Top 0.406: R7.2 93.5,11.1 92.7,11.9 92.7,12.6 88.5,16.8
LED3
  Top 0.4: U1.18 58.38,40.02 68.9,29.5 68.9,20.3 71.8,17.4 88.9,17.4
  Top 0.406: R8.2 93.5,12.8 88.9,17.4
LED4
  Top 0.4: U1.19 58.62,40.68 69.5,29.8 69.5,20.6 72.1,18 89.3,18
  Top 0.406: R33.2 92.8,14.5 89.3,18
LED5
  Top 0.4: U1.20 58.88,41.31 70.1,30.1 70.1,20.9 72.4,18.6 89.65,18.6
  Top 0.406: R34.2 92.15,16.1 89.65,18.6
N$2
  Bottom 0.5: U3.20 53.26,58.55 53.7,58.1 R1.1
N$3
  Bottom 0.5: U7.20 26.31,70.94 R2.1
N$4
  Bottom 0.5: R3.1 35.9,22.55 U13.20
N$5
  Bottom 0.5: U11.20 26.51,21.94 R4.1
N$6
  Bottom 0.5: U9.20 25.04,50.28 R5.1
N$7
  Top 0.52: R6.1 LED1.A
N$8
  Top 0.52: R7.1 LED2.A
N$9
  Top 0.52: R8.1 LED3.A
N$10
  Bottom 0.5: LED_5V.A 34.9,29.95 R15.2
N$11
  Top 0.52: R33.1 LED4.A
N$12
  Top 0.52: R34.1 LED5.A
N$15  (via drill 0.5 pad 0.5)
  Top 0.5: C5.1 49.69,62.3 v50.8,62.3
  Bottom 0.5: U3.17 49.41,62.3 v50.8,62.3
N$18  (via drill 0.5 pad 0.5)
  Top 0.5: R10.2 49.57,61 v50.8,61
  Bottom 0.5: U3.18 49.44,61 v50.8,61
N$20
  Bottom 0.5: D1.C arc-90 24.18,32.09 R13.1 22.66,31.66 22,30.9 20.84,30.9 U$2.4
N$21  (via drill 0.5)
  Bottom 4.6: BAT_GND.P$1 U$2.5
  other vias: 22.2,29.4 22.9,28 22.2,26.6 23.6,29.4 24.3,28 23.6,26.6 25,29.4 25.7,28 25,26.6 26.4,29.4 26.4,26.6
  pour Top (isolate 0.5, no thermals): 21.6,30.05 21.6,25.95 28.25,25.95 arc90 30.25,27.95 30.25,28.05 arc90 28.25,30.05
N$23
  Bottom 0.5: U3.7 35.5,65.55 | U3.6 35.65,65.55
  Bottom 2: M1_1.P$1 35.5,65.55 35.65,65.55
N$25
  Bottom 0.5: U3.14 49.6,65.55 U3.15
  Bottom 2: M1_2.P$1 49.6,65.55
N$31  (via drill 0.5 pad 0.5)
  Top 0.5: C15.1 21.2,71.27 v21.2,72.4
  Bottom 0.5: U7.17 21.2,70.98 v21.2,72.4
N$33  (via drill 0.5 pad 0.5)
  Top 0.5: R18.2 22.5,71.51 v22.5,72.4
  Bottom 0.5: U7.18 v22.5,72.4
N$34
  Bottom 0.5: U7.7 18.05,57.2 U7.6
  Bottom 2: M1_3.P$1 18.05,57.2
N$35
  Bottom 0.5: U7.14 18.05,71.2 18.7,70.9 U7.15
  Bottom 2: M1_4.P$1 18.05,71.2
N$36  (via drill 0.5 pad 0.5)
  Top 0.5: C20.1 21.2,48.95 v21.2,50.3
  Bottom 0.5: U9.17 21.2,48.67 v21.2,50.3
N$38  (via drill 0.5 pad 0.5)
  Top 0.5: R21.2 22.6,48.97 v22.6,50.3
  Bottom 0.5: U9.18 22.6,48.75 v22.6,50.3
N$39
  Bottom 0.5: U9.7 18.05,34.9 U9.6
  Bottom 2: M1_5.P$1 18.05,34.9
N$40
  Bottom 0.5: U9.14 18.05,48.9 U9.15
  Bottom 2: M1_6.P$1 18.05,48.9
N$41  (via drill 0.5 pad 0.5)
  Top 0.5: C25.1 21.2,22.23 v21.2,23.2
  Bottom 0.5: U11.17 21.2,21.96 v21.2,23.2
N$43  (via drill 0.5 pad 0.5)
  Top 0.5: U11.18 22.53,21.94 R24.2 22.5,22.33 v22.5,23.2
  Bottom 0.5: U11.18 22.5,21.96 v22.5,23.2
N$44
  Bottom 0.5: U11.6 18.05,8.2 U11.7
  Bottom 2: M1_7.P$1 18.05,8.2
N$45
  Bottom 0.5: U11.15 18.05,22.2 U11.14
  Bottom 2: M1_8.P$1 18.05,22.2
N$46  (via drill 0.5 pad 0.5)
  Top 0.5: C30.1 35.4,18.8 v34.4,18.8
  Bottom 0.5: U13.17 35.84,18.8 v34.4,18.8
N$48  (via drill 0.5 pad 0.5)
  Top 0.5: R27.2 35.61,20.1 v34.4,20.1
  Bottom 0.5: U13.18 35.81,20.1 v34.4,20.1
N$49
  Bottom 0.5: U13.7 49.6,15.55 U13.6
  Bottom 2: M1_9.P$1 49.6,15.55
N$50
  Bottom 0.5: U13.14 35.65,15.55 U13.15
  Bottom 2: M1_10.P$1 35.65,15.55
PWM1  (via drill 0.5)
  Top 0.4: v50.6,45.1 50.6,47.07 U2.7 | IC1.25 95.6,31.26 95.6,28 94.2,26.6 94.2,23.3 92.5,21.6 73.9,21.6 73.1,22.4 73.1,31.6 64.4,40.3 v64.4,41
  Bottom 0.5: R30.2 95.45,30.55 97.4,32.5 97.4,33.06 IC1.25 | v50.6,45.1 51.4,44.3 62.4,44.3 64.4,42.3 v64.4,41
PWM1_D  (via drill 0.5)
  Top 0.5: v51,67.4 51.2,67.4 52,66.6 52,54.9 50.62,53.52 U2.10
  Bottom 0.406: v51,67.4 49.39,67.4 U3.13
PWM2  (via drill 0.5)
  Top 0.4: v46.8,45.2 U2.4 | IC1.24 96.2,29.32 96.2,27.7 94.8,26.3 94.8,23 92.8,21 73.6,21 72.5,22.1 72.5,31.3 63.4,40.4 v63.4,41.8
  Bottom 0.5: v46.8,45.2 48.4,43.6 62,43.6 63.4,42.2 v63.4,41.8 | R28.2 95.8,28.4 97.5,30.1 97.5,30.54 IC1.24
PWM2_D  (via drill 0.5)
  Top 0.5: U2.13 46.8,53.4 44.9,55.3 34.6,55.3 32.9,57 v32.9,58.6
  Bottom 0.406: 16.2,70.99 U7.13
  Bottom 0.5: v32.9,58.6 29.4,62.1 29.4,69.1 28.8,69.7 16.8,69.7 16.1,70.4 16.1,70.89 U7.13
PWM3  (via drill 0.5)
  Top 0.4: v42,43.3 39.87,43.3 U6.7 | IC1.23 95.4,25.98 95.4,22.7 93.1,20.4 73.3,20.4 71.9,21.8 71.9,31 62.4,40.5 v62.4,41.1
  Bottom 0.5: R25.2 96.02,26.6 IC1.23 | v42,43.3 42.4,42.9 61.6,42.9 62.4,42.1 v62.4,41.1
PWM3_D  (via drill 0.5)
  Top 0.5: v16.2,50.2 16.2,50.3 17.1,51.2 31.5,51.2 33,49.7 33,43.9 33.5,43.4 34.35,43.4 U6.10
  Bottom 0.406: v16.2,50.2 16.2,48.7 U9.13
PWM4  (via drill 0.5)
  Top 0.4: v41.6,39.5 39.86,39.5 U6.4 | IC1.22 96,24.04 96,22.4 93.4,19.8 73,19.8 71.3,21.5 71.3,30.7 61.4,40.6 v61.4,41.8
  Bottom 0.5: R22.2 96.76,24.8 IC1.22 | v61.4,41.8 61,42.2 44.2,42.2 41.6,39.6 v41.6,39.5
PWM4_D  (via drill 0.5)
  Top 0.5: v16.1,23.4 16.1,23.5 17,24.4 30.4,24.4 31.3,25.3 31.3,37.3 33.6,39.6 U6.13
  Bottom 0.406: v16.1,23.4 16.1,22.01 U11.13
PWM5  (via drill 0.5)
  Top 0.4: v47.9,35.1 47.9,33.58 U8.4 | IC1.21 93.72,19.22 93.72,19.2 72.7,19.2 70.7,21.2 70.7,30.4 60.4,40.7 v60.4,41.1
  Bottom 0.5: v47.9,35.1 54.3,41.5 60,41.5 v60.4,41.1 | R19.2 95.49,22.96 IC1.21
PWM5_D  (via drill 0.5)
  Top 0.5: v34.5,13.6 34.1,13.6 33.5,14.2 33.5,25.6 34.6,26.7 47.3,26.7 47.84,27.25 U8.13
  Bottom 0.406: 35.85,13.6 U13.13
  Bottom 0.5: v34.5,13.6 35.85,13.6
RD+
  Bottom 0.5: X2.2 94.8,74.56 94.8,61.18 IC1.35 97.46,58.54
RD-
  Bottom 0.5: X2.1 95.5,63.02 IC1.36
SCL
  Top 0.4: U1.22 65.35,42.65 71.06,48.36 IC1.10
  Bottom 0.5: IC1.10 76.71,48.36 76.71,48.4 R9.1
SCL2
  Top 0.4: X10.3 76.83,77.67 80.2,74.3 82.4,74.3 84.3,72.4 94.2,72.4 94.9,71.7 94.9,43.9 96.8,42 98,42 98.7,41.3 98.7,39.4 97.5,38.2 IC1.27
  Bottom 0.5: R32.1 IC1.27
SDA
  Top 0.4: U1.23 65.08,43.28 70.9,49.1 72.8,49.1 IC1.9
  Bottom 0.5: R14.1 IC1.9
SDA2
  Top 0.4: X10.4 76.72,73.7 82.1,73.7 84,71.8 93.9,71.8 94.3,71.4 94.3,43.6 97.16,40.74 IC1.28
  Bottom 0.5: R31.1 95.49,40.74 IC1.28
TD+
  Bottom 0.5: X2.4 91.69,74.91 93.4,73.2 93.4,59 96.1,56.3 96.1,54.8 IC1.33
TD-
  Bottom 0.5: X2.3 92.97,74.64 94.1,73.5 94.1,59.34 IC1.34
VCC
  Top 0.4: 52.97,33.37 55.6,36 59.7,36 67.1,28.6 67.1,19.4 70.9,15.6 71.7,15.6 74.4,12.9 74.4,7.3 73.13,6.03
  Top 0.5: 43,46.99 43,47.8 43.6,48.4 55.87,48.4 56.4,47.87 | 43,46.99 U2.1 | 43,46.99 41.94,46.99 C10.1 41.23,46.73 40.1,45.6 38.75,45.6 38.4,45.25 38.4,36.4 39,35.8 U6.1 41.2,35.8 C12.1 41.58,32.88 42.26,32.2 51.1,32.2 51.66,32.76 U8.1 51.81,33.37 52.97,33.37 C16.1 53.67,33.37 53.7,33.4 53.7,32.7 54.1,32.3 56.05,32.3 56.42,31.92 | IC1.2 74.6,68.6 73,67 73,54 64.3,45.3 59,45.3 56.43,47.87 56.4,47.87 | X6.2 56.4,49.67 | X4.2 56.4,57.87 | 56.4,57.87 56.4,49.67 | X3.2 56.4,66.06 56.4,57.87 | 56.4,49.67 56.4,47.87 | 56.42,31.92 X7.2 | X8.2 56.42,23.73 | 56.42,23.73 56.42,31.92 | 56.42,23.73 56.42,17.28 60.2,13.5 60.2,13.04 X1.3 | 73.13,6.03 X9.2
  Bottom 0.5: R16.2 77.34,6 X9.2
  Bottom 1.6: U$3.P$8 U$3.P$7 87.8,67.98 87.8,69.1 86.7,70.2 81.3,70.2 79.78,68.68 IC1.2

### Text on the board
tNames: M1 | M2 | + | M3 | + | + | M4 | T2+ MB 0.2 | M5 | +